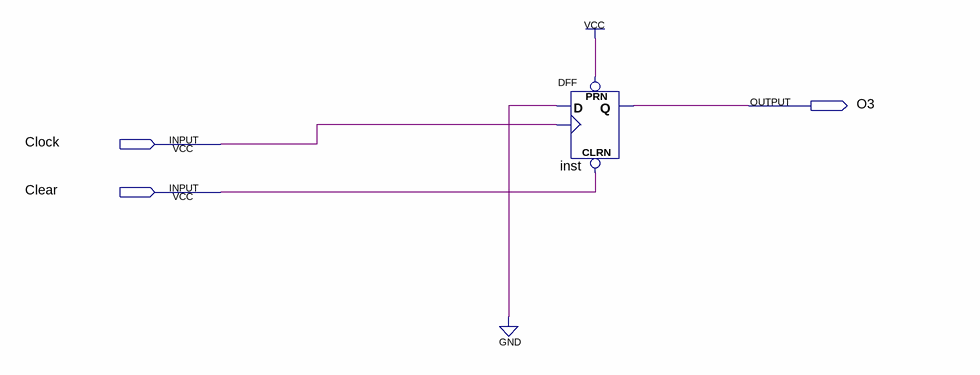
[diagram p0: schematic sheet]
// Quartus schematic 06D3.bdf as structural Verilog: 1 symbols, 3 pins
module \06D3  (
  input  Clock,
  input  Clear,
  output O3
);

  DFF inst (.CLRN(Clear), .CLK(Clock), .D(1'b0), .PRN(1'b1), .Q(O3));
endmodule
